# Altium schematic sheet mboard_pwr_harvewster.SchDoc: =GlobalProjectName
size 209 x 297 mm; SheetNumber: Лист; SheetTotal: Листов; PageSetup: Record=PageOptions|CenterHorizontal=True|CenterVertical=True|PrintScale=1.00|XCorrection=1.00|YCorrection=1.00|PrintKind=1|BorderSize=5000000|LeftOffset=0|BottomOffset=0|Orientation=2|PaperLength=1000|PaperWidth=1000|Scale=100|PaperSource=15|PrintQuality=1200|MediaType=1|DitherType=10|PaperKind=A3|PrintScaleMode=1; Weight: -; ScaleFactor: -
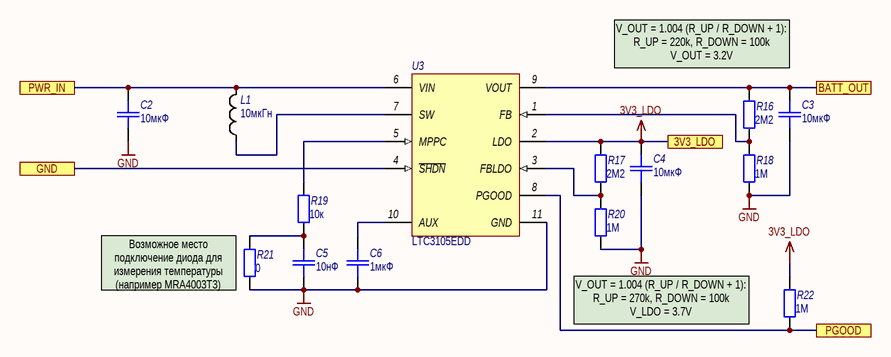
[diagram p0: mboard_pwr_harvewster.SchDoc]

## Parts
C2  10мкФ  [SMD_C0603]
C3  10мкФ  [SMD_C0603]
C4  10мкФ  [SMD_C0603]
C5  10нФ  [SMD_C0603]
C6  1мкФ  [SMD_C0603]
L1  value 10мкГн  [INDUCTOR-4x4]  (hidden comment: LPS4018-223ML)
R16  2M2  [SMD_0603]
R17  2M2  [SMD_0603]
R18  1M  [SMD_0603]
R19  10к  [SMD_0603]
R20  1M  [SMD_0603]
R21  0  [SMD_0603]
R22  1M  [SMD_0603]
U3  LTC3105EDD  [LFQC-10_3x3]

## Ports
3V3_LDO, BATT_OUT, GND, PGOOD, PWR_IN

## Nets
3V3_LDO: C4.2 R17.2 R22.2 U3.2(LDO) ; port 3V3_LDO
GND: C2.2 C3.1 C4.1 C5.2 C6.2 R18.1 R20.1 R21.1 U3.11(GND)
BATT_OUT: C3.2 R16.2 U3.9(VOUT) ; port BATT_OUT
GND: U3.4(~{SHDN}) ; port GND  [a separate net that carries the same name]
PGOOD: R22.1 U3.8(PGOOD) ; port PGOOD
PWR_IN: C2.1 L1.2 U3.6(VIN) ; port PWR_IN
NetC5_1: C5.1 R19.1 R21.2
NetC6_1: C6.1 U3.10(AUX)
NetL1_1: L1.1 U3.7(SW)
NetR16_1: R16.1 R18.2 U3.1(FB)
NetR17_1: R17.1 R20.2 U3.3(FBLDO)
NetR19_2: R19.2 U3.5(MPPC)

## Notes on the sheet
- V_OUT = 1.004 (R_UP / R_DOWN + 1):
  R_UP = 220k, R_DOWN = 100k
  V_OUT = 3.2V
- (near R21) Возможное место подключение диода для измерения температуры (например MRA4003T3)
- V_OUT = 1.004 (R_UP / R_DOWN + 1):
  R_UP = 270k, R_DOWN = 100k
  V_LDO = 3.7V
- Подп. и дата
- Инв. № дубл.
- Взам. инв. №
- Инв. № подл.
- Изм.
- Лист
- № докум.
- Подп.
- Дата
- Форма 2а ГОСТ 2.104-2006
- Копировал
- Формат А4

## Library data of the parts
C2-C6 = Capacitor: Назначение: SMD-конденсатор; Наименование: Конденсатор; Потребление, Вт: 0
  C2-C4: Value: 10мкФ
  C5: Value: 10нФ
  C6: Value: 1мкФ
L1 = Inductor: Наименование: LPS4018-103ML; Назначение: SMD-индуктивность; Потребление, Вт: 0,010
R16-R22 = Resistor: Наименование: Резистор; Назначение: SMD-резистор; Потребление, Вт: 0,001
  R16 R17: Value: 2M2
  R18 R20 R22: Value: 1M
  R19: Value: 10к
  R21: Value: 0
U3 = LTC3105EDD: 400 mA Step-Up DC/DC Converter with Maximum Power Point Control and 250 mV Start-Up, 10-pin SON (DD-10), -40 to 85 degC, Pb-Free, Tape and Reel; PartNumber: LTC3105EDD#TRPBF; Manufacturer: Linear Technology; Topology: Boost; Vout Max(V): 5.25; Vin Min(V): 0.225; Number of Outputs: 1; Vin Max(V): 5; Energy Source: Solar; Назначение: 400 mA Step-Up DC/DC Converter with MPPЕ Control and 250 mV Start-Up; Потребление, Вт: 0.001; ComponentLink3Description: Package Specification; Code_JEDEC: MO-229; PackageDescription: 10-Pin Plastic DFN, Body 3 x 3 mm, Pitch 0.5 mm; Packing: Tape and Reel; Mounting Technology: Surface Mount; PackageVersion: Rev. C, 06/2010; ComponentLink1Description: Manufacturer URL; DatasheetVersion: Rev. A; ComponentLink2Description: Datasheet; ComponentLink2URL: http://cds.linear.com/docs/en/datasheet/3105fa.pdf; ComponentLink1URL: http://www.linear.com/; RoHS: TRUE; PackageReference: DD-10; ComponentLink3URL: http://cds.linear.com/docs/en/packaging/DFN_10_05-08-1699.pdf; Наименование: LTC3105EDD